# Altium schematic sheet RTU_LMG_RTC_Linear_Voltage_Regulator_3V3.SchDoc
size A4; SheetNumber: 17; SheetTotal: 17
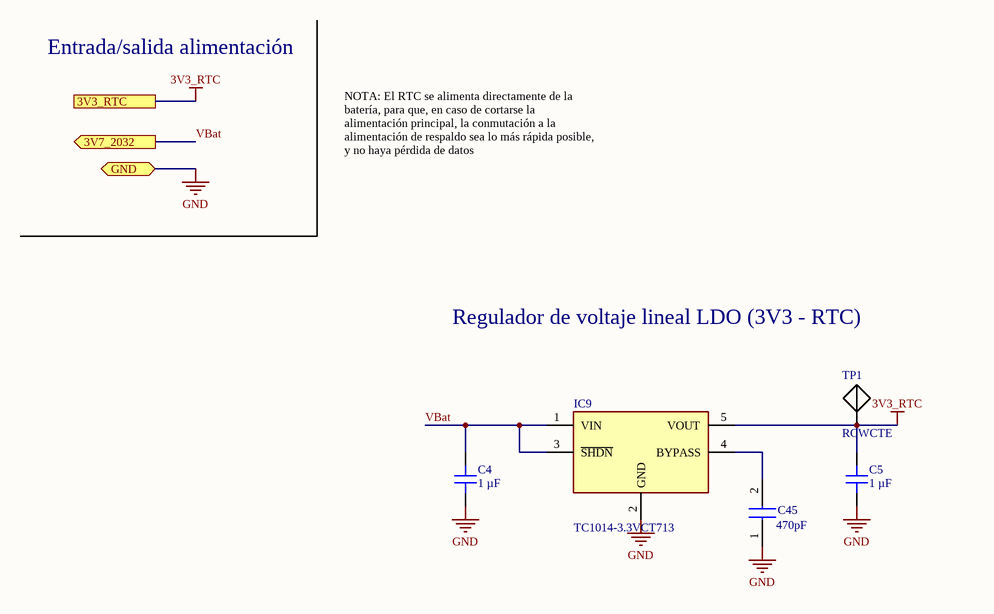
[diagram p0: RTU_LMG_RTC_Linear_Voltage_Regulator_3V3.SchDoc]

## Parts
C4  1 µF  [CAP 0402_1005]
C5  1 µF  [CAP 0402_1005]
C45  470pF  [CAPACITOR_SMD_0402]
IC9  TC1014-3.3VCT713  [SOT-23-5]
TP1  RCWCTE  [RCWCTE]

## Ports
3V3_RTC, 3V7_2032 (out), GND (bidir)

## Nets
3V3_RTC: C5.1 IC9.5(VOUT) TP1.1(TP) ; port 3V3_RTC
GND: C4.2 C5.2 C45.1 IC9.2(GND) ; port GND
VBat: C4.1 IC9.1(VIN) IC9.3(~{SHDN}) ; port 3V7_2032
NetC45_2: C45.2 IC9.4(BYPASS)

## Notes on the sheet
- Entrada/salida alimentación
- NOTA: El RTC se alimenta directamente de la batería, para que, en caso de cortarse la alimentación principal, la conmutación a la alimentación de respaldo sea lo más rápida posible, y no haya pérdida de datos
- Regulador de voltaje lineal LDO (3V3 - RTC)

## Library data of the parts
C4 C5 = CL05A105KO5NNNC: CAP CER 1UF 16V X5R 0402; manufacturer: Samsung Electro-Mechanics; Tolerance: ±10%; Part Number: CL05A105KO5NNNC; Value: 1 µF; Applications: General Purpose; Capacitance: 1 µF; componentlink1description: Datasheet; componentlink1url: http://www.samsungsem.com/kr/support/product-search/mlcc/CL05A105KO5NNNC.jsp; componentlink2description: DigiKey Link; componentlink2url: https://www.digikey.com/en/products/detail/samsung-electro-mechanics/CL05A105KO5NNNC/3886725; Device Package: 0402 (1005 Metric); lastupdated: 10/29/2023 7:04:16 PM; Lifecycle Status: Active; Minimum Order: 1; Mounting Type: Surface Mount, MLCC; Operating Temperature: -55°C ~ 85°C; Package / Case: 0402 (1005 Metric); packaging: TapeAndReel; partid: 3120; Part Status: Active; price: 0.01; series: CL; Size / Dimension: 0.039" L x 0.020" W (1.00mm x 0.50mm); Supplier 1: DigiKey; Supplier Part Number 1: 1276-1067-1-ND; Temperature Coefficient: X5R; Thickness (Max): 0.022" (0.55mm); Voltage - Rated: 16V
C45 = GRM155R71H471KA01D: Capacitor; Manufacturer_Name: Murata Electronics; Datasheet Link: http://www.murata.com/~/media/webrenewal/support/library/catalog/products/capacitor/mlcc/c02e.pdf; Height: 0.55mm; Manufacturer_Part_Number: GRM155R71H471KA01D; Mouser Part Number: 81-GRM36X471K50; Mouser Price/Stock: https://www.mouser.co.uk/ProductDetail/Murata-Electronics/GRM155R71H471KA01D?qs=sT7emLDNC7WVnfHKtuvzhw%3D%3D; Arrow Part Number: GRM155R71H471KA01D; Arrow Price/Stock: https://www.arrow.com/en/products/grm155r71h471ka01d/murata-manufacturing?region=nac
IC9 = TC1014-3.3VCT713: Fuente regulada LDO - 3V3 - 50mA; Manufacturer_Name: Microchip; Datasheet Link: https://datasheet.datasheetarchive.com/originals/distributors/Datasheets-19/DSA-360691.pdf; Height: 1.45mm; Manufacturer_Part_Number: TC1014-3.3VCT713; Mouser Part Number: 579-TC1014-3.3VCT713; Mouser Price/Stock: https://www.mouser.co.uk/ProductDetail/Microchip-Technology/TC1014-3.3VCT713?qs=wPbeaPfwU991F7oXZ7xn4Q%3D%3D; Arrow Part Number: TC1014-3.3VCT713; Arrow Price/Stock: https://www.arrow.com/en/products/tc1014-3.3vct713/microchip-technology
TP1 = RCWCTE: - PC Test Point - - Plating Surface Mount Mounting Type; MF: KOA Speer; Check_prices: https://www.snapeda.com/parts/RCWCTE/KOA+Speer/view-part/?ref=eda; SnapEDA_Link: https://www.snapeda.com/parts/RCWCTE/KOA+Speer/view-part/?ref=snap; Digi-Key_Part_Number: 2019-RCWCTETR-ND; Value: *; Purchase-URL: https://pricing.snapeda.com/search/part/RCWCTE/?ref=eda; Package: None; MP: RCWCTE